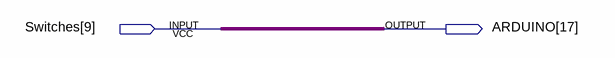
[diagram p0: schematic sheet]
// Quartus schematic pintest.bdf as structural Verilog: 0 symbols, 2 pins
module pintest (
  input  [9:9] Switches,
  output [17:17] ARDUINO
);


  assign ARDUINO[17] = Switches[9];
endmodule
